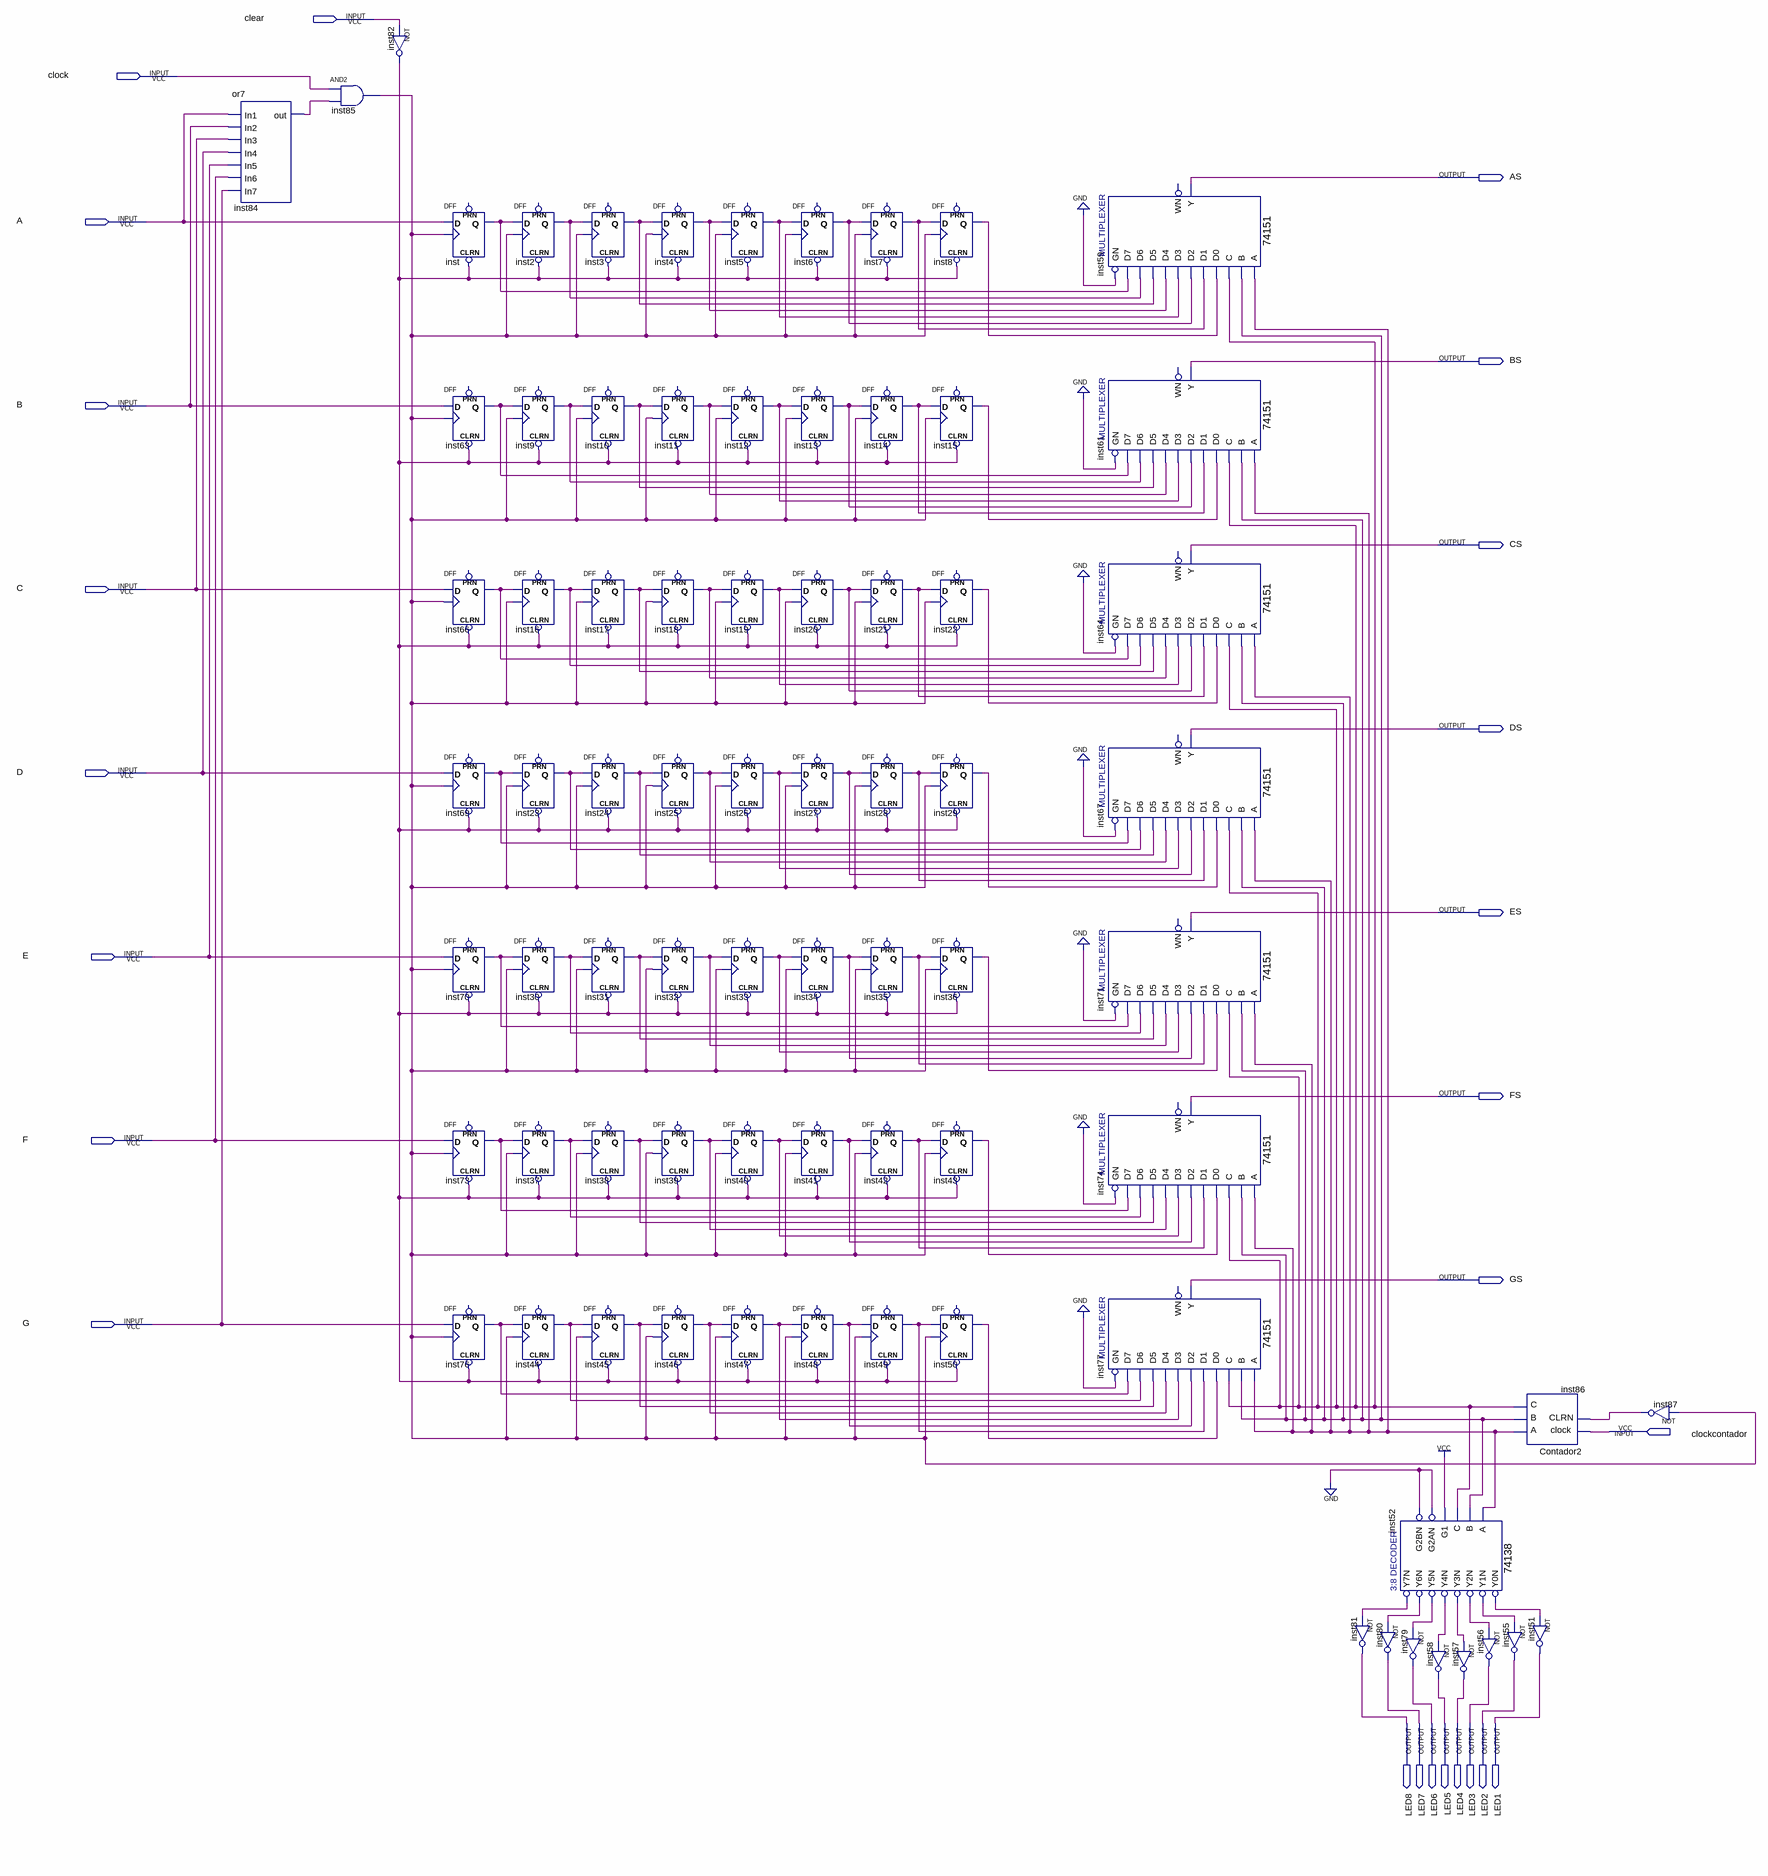
[diagram p0: schematic sheet]
// Quartus schematic Memoria.bdf as structural Verilog: 77 symbols, 25 pins
module Memoria (
  input  clear,
  input  clock,
  input  A,
  input  B,
  input  C,
  input  D,
  input  E,
  input  F,
  input  G,
  input  clockcontador,
  output AS,
  output BS,
  output CS,
  output DS,
  output ES,
  output FS,
  output GS,
  output LED8,
  output LED7,
  output LED6,
  output LED5,
  output LED4,
  output LED3,
  output LED2,
  output LED1
);

  wire inst2_q, inst3_q, inst4_q, inst5_q, inst6_q, inst7_q, inst8_q, inst9_q, inst10_q, inst11_q, inst12_q,
       inst13_q, inst14_q, inst15_q, inst16_q, inst17_q, inst18_q, inst19_q, inst20_q, inst21_q, inst22_q,
       inst23_q, inst24_q, inst25_q, inst26_q, inst27_q, inst28_q, inst29_q, inst30_q, inst31_q, inst32_q,
       inst33_q, inst34_q, inst35_q, inst36_q, inst37_q, inst38_q, inst39_q, inst40_q, inst41_q, inst42_q,
       inst43_q, inst44_q, inst45_q, inst46_q, inst47_q, inst48_q, inst49_q, inst50_q, inst52_y0n,
       inst52_y1n, inst52_y2n, inst52_y3n, inst52_y4n, inst52_y5n, inst52_y6n, inst52_y7n, inst63_q,
       inst66_q, inst69_q, inst70_q, inst73_q, inst76_q, inst82_out, inst84_out, inst85_out, inst86_a,
       inst86_b, inst86_c, inst87_out, inst_q;

  or inst84 (inst84_out, A, B, C, D, E, F, G);
  and inst85 (inst85_out, clock, inst84_out);
  not inst82 (inst82_out, clear);
  DFF inst (.CLRN(inst82_out), .CLK(inst85_out), .D(A), .Q(inst_q));  // open: PRN
  DFF inst63 (.CLRN(inst82_out), .CLK(inst85_out), .D(B), .Q(inst63_q));  // open: PRN
  DFF inst66 (.CLRN(inst82_out), .CLK(inst85_out), .D(C), .Q(inst66_q));  // open: PRN
  DFF inst69 (.CLRN(inst82_out), .CLK(inst85_out), .D(D), .Q(inst69_q));  // open: PRN
  DFF inst70 (.CLRN(inst82_out), .CLK(inst85_out), .D(E), .Q(inst70_q));  // open: PRN
  DFF inst73 (.CLRN(inst82_out), .CLK(inst85_out), .D(F), .Q(inst73_q));  // open: PRN
  DFF inst76 (.CLRN(inst82_out), .CLK(inst85_out), .D(G), .Q(inst76_q));  // open: PRN
  DFF inst2 (.CLRN(inst82_out), .CLK(inst85_out), .D(inst_q), .Q(inst2_q));  // open: PRN
  DFF inst9 (.CLRN(inst82_out), .CLK(inst85_out), .D(inst63_q), .Q(inst9_q));  // open: PRN
  DFF inst16 (.CLRN(inst82_out), .CLK(inst85_out), .D(inst66_q), .Q(inst16_q));  // open: PRN
  DFF inst23 (.CLRN(inst82_out), .CLK(inst85_out), .D(inst69_q), .Q(inst23_q));  // open: PRN
  DFF inst30 (.CLRN(inst82_out), .CLK(inst85_out), .D(inst70_q), .Q(inst30_q));  // open: PRN
  DFF inst37 (.CLRN(inst82_out), .CLK(inst85_out), .D(inst73_q), .Q(inst37_q));  // open: PRN
  DFF inst44 (.CLRN(inst82_out), .CLK(inst85_out), .D(inst76_q), .Q(inst44_q));  // open: PRN
  DFF inst3 (.CLRN(inst82_out), .CLK(inst85_out), .D(inst2_q), .Q(inst3_q));  // open: PRN
  DFF inst10 (.CLRN(inst82_out), .CLK(inst85_out), .D(inst9_q), .Q(inst10_q));  // open: PRN
  DFF inst17 (.CLRN(inst82_out), .CLK(inst85_out), .D(inst16_q), .Q(inst17_q));  // open: PRN
  DFF inst24 (.CLRN(inst82_out), .CLK(inst85_out), .D(inst23_q), .Q(inst24_q));  // open: PRN
  DFF inst31 (.CLRN(inst82_out), .CLK(inst85_out), .D(inst30_q), .Q(inst31_q));  // open: PRN
  DFF inst38 (.CLRN(inst82_out), .CLK(inst85_out), .D(inst37_q), .Q(inst38_q));  // open: PRN
  DFF inst45 (.CLRN(inst82_out), .CLK(inst85_out), .D(inst44_q), .Q(inst45_q));  // open: PRN
  DFF inst4 (.CLRN(inst82_out), .CLK(inst85_out), .D(inst3_q), .Q(inst4_q));  // open: PRN
  DFF inst11 (.CLRN(inst82_out), .CLK(inst85_out), .D(inst10_q), .Q(inst11_q));  // open: PRN
  DFF inst18 (.CLRN(inst82_out), .CLK(inst85_out), .D(inst17_q), .Q(inst18_q));  // open: PRN
  DFF inst25 (.CLRN(inst82_out), .CLK(inst85_out), .D(inst24_q), .Q(inst25_q));  // open: PRN
  DFF inst32 (.CLRN(inst82_out), .CLK(inst85_out), .D(inst31_q), .Q(inst32_q));  // open: PRN
  DFF inst39 (.CLRN(inst82_out), .CLK(inst85_out), .D(inst38_q), .Q(inst39_q));  // open: PRN
  DFF inst46 (.CLRN(inst82_out), .CLK(inst85_out), .D(inst45_q), .Q(inst46_q));  // open: PRN
  DFF inst5 (.CLRN(inst82_out), .CLK(inst85_out), .D(inst4_q), .Q(inst5_q));  // open: PRN
  DFF inst12 (.CLRN(inst82_out), .CLK(inst85_out), .D(inst11_q), .Q(inst12_q));  // open: PRN
  DFF inst19 (.CLRN(inst82_out), .CLK(inst85_out), .D(inst18_q), .Q(inst19_q));  // open: PRN
  DFF inst26 (.CLRN(inst82_out), .CLK(inst85_out), .D(inst25_q), .Q(inst26_q));  // open: PRN
  DFF inst33 (.CLRN(inst82_out), .CLK(inst85_out), .D(inst32_q), .Q(inst33_q));  // open: PRN
  DFF inst40 (.CLRN(inst82_out), .CLK(inst85_out), .D(inst39_q), .Q(inst40_q));  // open: PRN
  DFF inst47 (.CLRN(inst82_out), .CLK(inst85_out), .D(inst46_q), .Q(inst47_q));  // open: PRN
  DFF inst6 (.CLRN(inst82_out), .CLK(inst85_out), .D(inst5_q), .Q(inst6_q));  // open: PRN
  DFF inst13 (.CLRN(inst82_out), .CLK(inst85_out), .D(inst12_q), .Q(inst13_q));  // open: PRN
  DFF inst20 (.CLRN(inst82_out), .CLK(inst85_out), .D(inst19_q), .Q(inst20_q));  // open: PRN
  DFF inst27 (.CLRN(inst82_out), .CLK(inst85_out), .D(inst26_q), .Q(inst27_q));  // open: PRN
  DFF inst34 (.CLRN(inst82_out), .CLK(inst85_out), .D(inst33_q), .Q(inst34_q));  // open: PRN
  DFF inst41 (.CLRN(inst82_out), .CLK(inst85_out), .D(inst40_q), .Q(inst41_q));  // open: PRN
  DFF inst48 (.CLRN(inst82_out), .CLK(inst85_out), .D(inst47_q), .Q(inst48_q));  // open: PRN
  DFF inst7 (.CLRN(inst82_out), .CLK(inst85_out), .D(inst6_q), .Q(inst7_q));  // open: PRN
  DFF inst14 (.CLRN(inst82_out), .CLK(inst85_out), .D(inst13_q), .Q(inst14_q));  // open: PRN
  DFF inst21 (.CLRN(inst82_out), .CLK(inst85_out), .D(inst20_q), .Q(inst21_q));  // open: PRN
  DFF inst28 (.CLRN(inst82_out), .CLK(inst85_out), .D(inst27_q), .Q(inst28_q));  // open: PRN
  DFF inst35 (.CLRN(inst82_out), .CLK(inst85_out), .D(inst34_q), .Q(inst35_q));  // open: PRN
  DFF inst42 (.CLRN(inst82_out), .CLK(inst85_out), .D(inst41_q), .Q(inst42_q));  // open: PRN
  DFF inst49 (.CLRN(inst82_out), .CLK(inst85_out), .D(inst48_q), .Q(inst49_q));  // open: PRN
  DFF inst8 (.CLRN(inst82_out), .CLK(inst85_out), .D(inst7_q), .Q(inst8_q));  // open: PRN
  DFF inst15 (.CLRN(inst82_out), .CLK(inst85_out), .D(inst14_q), .Q(inst15_q));  // open: PRN
  DFF inst22 (.CLRN(inst82_out), .CLK(inst85_out), .D(inst21_q), .Q(inst22_q));  // open: PRN
  DFF inst29 (.CLRN(inst82_out), .CLK(inst85_out), .D(inst28_q), .Q(inst29_q));  // open: PRN
  DFF inst36 (.CLRN(inst82_out), .CLK(inst85_out), .D(inst35_q), .Q(inst36_q));  // open: PRN
  DFF inst43 (.CLRN(inst82_out), .CLK(inst85_out), .D(inst42_q), .Q(inst43_q));  // open: PRN
  DFF inst50 (.CLRN(inst82_out), .CLK(inst85_out), .D(inst49_q), .Q(inst50_q));  // open: PRN
  \74151  inst59 (
    .GN(1'b0), .C(inst86_c), .B(inst86_b), .A(inst86_a), .D5(inst3_q), .D0(inst8_q), .D1(inst7_q),
    .D4(inst4_q), .D3(inst5_q), .D2(inst6_q), .D6(inst2_q), .D7(inst_q), .Y(AS));  // open: WN
  \74151  inst61 (
    .GN(1'b0), .C(inst86_c), .B(inst86_b), .A(inst86_a), .D5(inst10_q), .D0(inst15_q), .D1(inst14_q),
    .D4(inst11_q), .D3(inst12_q), .D2(inst13_q), .D6(inst9_q), .D7(inst63_q), .Y(BS));  // open: WN
  \74151  inst64 (
    .GN(1'b0), .C(inst86_c), .B(inst86_b), .A(inst86_a), .D5(inst17_q), .D0(inst22_q), .D1(inst21_q),
    .D4(inst18_q), .D3(inst19_q), .D2(inst20_q), .D6(inst16_q), .D7(inst66_q), .Y(CS));  // open: WN
  \74151  inst67 (
    .GN(1'b0), .C(inst86_c), .B(inst86_b), .A(inst86_a), .D5(inst24_q), .D0(inst29_q), .D1(inst28_q),
    .D4(inst25_q), .D3(inst26_q), .D2(inst27_q), .D6(inst23_q), .D7(inst69_q), .Y(DS));  // open: WN
  \74151  inst71 (
    .GN(1'b0), .C(inst86_c), .B(inst86_b), .A(inst86_a), .D5(inst31_q), .D0(inst36_q), .D1(inst35_q),
    .D4(inst32_q), .D3(inst33_q), .D2(inst34_q), .D6(inst30_q), .D7(inst70_q), .Y(ES));  // open: WN
  \74151  inst74 (
    .GN(1'b0), .C(inst86_c), .B(inst86_b), .A(inst86_a), .D5(inst38_q), .D0(inst43_q), .D1(inst42_q),
    .D4(inst39_q), .D3(inst40_q), .D2(inst41_q), .D6(inst37_q), .D7(inst73_q), .Y(FS));  // open: WN
  \74151  inst77 (
    .GN(1'b0), .C(inst86_c), .B(inst86_b), .A(inst86_a), .D5(inst45_q), .D0(inst50_q), .D1(inst49_q),
    .D4(inst46_q), .D3(inst47_q), .D2(inst48_q), .D6(inst44_q), .D7(inst76_q), .Y(GS));  // open: WN
  not inst81 (LED8, inst52_y7n);
  \74138  inst52 (
    .A(inst86_a), .B(inst86_b), .G1(1'b1), .C(inst86_c), .G2AN(1'b0), .G2BN(1'b0), .Y0N(inst52_y0n),
    .Y1N(inst52_y1n), .Y2N(inst52_y2n), .Y3N(inst52_y3n), .Y4N(inst52_y4n), .Y5N(inst52_y5n),
    .Y6N(inst52_y6n), .Y7N(inst52_y7n));
  not inst80 (LED7, inst52_y6n);
  not inst79 (LED6, inst52_y5n);
  not inst57 (LED4, inst52_y3n);
  not inst58 (LED5, inst52_y4n);
  not inst55 (LED2, inst52_y1n);
  not inst56 (LED3, inst52_y2n);
  Contador2 inst86 (.clock(clockcontador), .CLRN(inst87_out), .A(inst86_a), .B(inst86_b), .C(inst86_c));
  not inst51 (LED1, inst52_y0n);
  not inst87 (inst87_out, inst85_out);
endmodule
